# Altium schematic sheet Voltage Regulator.SchDoc
size A; SheetNumber: 3; SheetTotal: 3
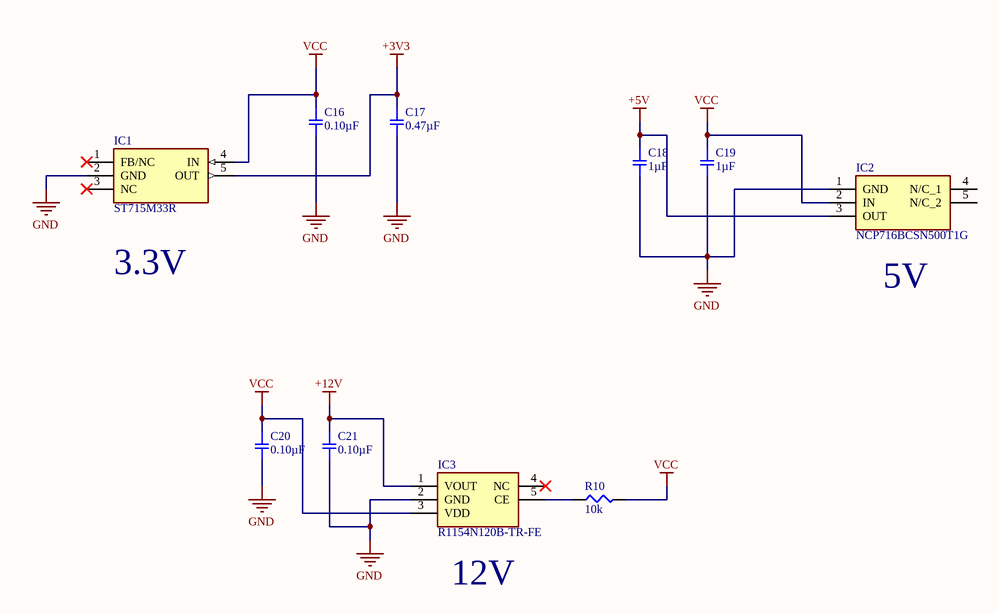
[diagram p0: Voltage Regulator.SchDoc]

## Parts
C16  0.10µF  [SMD-0402C]
C17  0.47µF  [SMD-0402C]
C18  1µF  [SMD-0402C]
C19  1µF  [SMD-0402C]
C20  0.10µF  [SMD-0402C]
C21  0.10µF  [SMD-0402C]
IC1  ST715M33R  [SOT95P280X145-5N]
IC2  NCP716BCSN500T1G  [SOT95P275X110-5N]
IC3  R1154N120B-TR-FE  [SOT95P280X130-5N]
R10  10k  [SMD-0402-RES]

## Nets
+3V3: C17.1 IC1.5(OUT)
+5V: C18.1 IC2.3(OUT)
+12V: C21.1 IC3.1(VOUT)
GND: C16.2 C17.2 C18.2 C19.2 C20.2 C21.2 IC1.2(GND) IC2.1(GND) IC3.2(GND)
VCC: C16.1 C19.1 C20.1 IC1.4(IN) IC2.2(IN) IC3.3(VDD) R10.2
NetIC3_5: IC3.5(CE) R10.1

Not connected (* = marked no-connect by the designer): IC1 1(FB/NC)* 3(NC)*; IC2 4(N/C_1) 5(N/C_2); IC3 4(NC)*

## Notes on the sheet
- 3.3V
- (near IC2) 5V
- (near IC3) 12V

## Library data of the parts
C16 C20 C21 = GCM155R71C104KA55D: CAP CER 0.1UF 16V X7R 0402; Manufacturer: Murata Electronics North America; Factory Stock: 0; Unit Price (USD): 0.1; Minimum Quantity: 1; Tolerance: ±10%; Datasheets: http://www.murata.com/~/media/webrenewal/support/library/catalog/products/capacitor/mlcc/c03e.ashx; Image: //media.digikey.com/Renders/Murata%20Renders/ZRB-SERIES-0402.jpg; Digi-Key Part Number: 490-4759-1-ND; Part Number: GCM155R71C104KA55D; Quantity Available: 734194; @ qty: 0; Packaging: Cut Tape (CT); Series: GCM; Part Status: Active; Value: 0.10µF; Voltage: 16V; Temperature Coefficient: X7R; Operating Temperature: -55°C ~ 125°C; Features: -; Ratings: AEC-Q200; Applications: Automotive; Mounting Type: Surface Mount, MLCC; Package / Case: 0402 (1005 Metric); Size / Dimension: 0.039" L x 0.020" W (1.00mm x 0.50mm); Height - Seated (Max): -; Thickness (Max): 0.022" (0.55mm); Lead Spacing: -; Lead Style: -
C17 = GRM155R61C474KE01D: CAP CER 0.47UF 16V X5R 0402; Manufacturer: Murata Electronics North America; Factory Stock: 0; Unit Price (USD): 0.1; Minimum Quantity: 1; Tolerance: ±10%; Datasheets: http://www.murata.com/~/media/webrenewal/support/library/catalog/products/capacitor/mlcc/c02e.pdf; Image: //media.digikey.com/Renders/Murata%20Renders/ZRB-SERIES-0402.jpg; Digi-Key Part Number: 490-13421-1-ND; Part Number: GRM155R61C474KE01D; Quantity Available: 8585; @ qty: 0; Packaging: Cut Tape (CT); Series: GRM; Part Status: Active; Value: 0.47µF; Voltage: 16V; Temperature Coefficient: X5R; Operating Temperature: -55°C ~ 85°C; Features: -; Ratings: -; Applications: General Purpose; Mounting Type: Surface Mount, MLCC; Package / Case: 0402 (1005 Metric); Size / Dimension: 0.039" L x 0.020" W (1.00mm x 0.50mm); Height - Seated (Max): -; Thickness (Max): 0.022" (0.55mm); Lead Spacing: -; Lead Style: -
C18 C19 = GRM155C81C105KE11D: CAP CER 1UF 16V X6S 0402; Manufacturer: Murata Electronics North America; Factory Stock: 0; Unit Price (USD): 0.29; Minimum Quantity: 1; Tolerance: ±10%; Datasheets: http://www.murata.com/~/media/webrenewal/support/library/catalog/products/capacitor/mlcc/c02e.pdf; Image: //media.digikey.com/Renders/Murata%20Renders/ZRB-SERIES-0402.jpg; Digi-Key Part Number: 490-12700-1-ND; Part Number: GRM155C81C105KE11D; Quantity Available: 37242; @ qty: 0; Packaging: Cut Tape (CT); Series: GRM; Part Status: Active; Value: 1µF; Voltage: 16V; Temperature Coefficient: X6S; Operating Temperature: -55°C ~ 105°C; Features: -; Ratings: -; Applications: General Purpose; Mounting Type: Surface Mount, MLCC; Package / Case: 0402 (1005 Metric); Size / Dimension: 0.039" L x 0.020" W (1.00mm x 0.50mm); Height - Seated (Max): -; Thickness (Max): 0.024" (0.60mm); Lead Spacing: -; Lead Style: -
IC1 = ST715M33R: Integrated Circuit; Manufacturer_Name: STMicroelectronics; Datasheet Link: https://datasheet.datasheetarchive.com/originals/distributors/Datasheets-DGA25/1774080.pdf; Height: 1.45mm; Manufacturer_Part_Number: ST715M33R; Mouser Part Number: 511-ST715M33R; Mouser Price/Stock: https://www.mouser.co.uk/ProductDetail/STMicroelectronics/ST715M33R?qs=SU4Xa%252BYHGQp%252B3Qoof482xw%3D%3D; Arrow Part Number: ST715M33R; Arrow Price/Stock: https://www.arrow.com/en/products/st715m33r/stmicroelectronics?region=nac
IC2 = NCP716BCSN500T1G: Integrated Circuit; Manufacturer_Name: onsemi; Datasheet Link: https://www.mouser.jp/datasheet/2/308/NCP716BC_D-2255835.pdf; Height: 1.1mm; Manufacturer_Part_Number: NCP716BCSN500T1G; Mouser Part Number: 863-NCP716BCSN500T1G; Mouser Price/Stock: https://www.mouser.co.uk/ProductDetail/onsemi/NCP716BCSN500T1G?qs=stqOd1AaK79aqdrzlQcxdg%3D%3D; Arrow Part Number: NCP716BCSN500T1G; Arrow Price/Stock: https://www.arrow.com/en/products/ncp716bcsn500t1g/on-semiconductor?region=nac
IC3 = R1154N120B-TR-FE: Integrated Circuit; Manufacturer_Name: Nisshinbo; Datasheet Link: https://www.nisshinbo-microdevices.co.jp/en/pdf/datasheet/r1154-ea.pdf; Height: 1.3mm; Manufacturer_Part_Number: R1154N120B-TR-FE; Mouser Part Number: 848-R1154N120BTRFE; Mouser Price/Stock: https://www.mouser.co.uk/ProductDetail/Nisshinbo/R1154N120B-TR-FE?qs=ilL34mSzaLixPjYq%2FYViaw%3D%3D
R10 = ERJ-2GEJ103X: RES SMD 10K OHM 5% 1/10W 0402; Manufacturer: Panasonic Electronic Components; Factory Stock: 0; Unit Price (USD): 0.00350; @ qty: 1500; Minimum Quantity: 1; Power (Watts): 0.1W, 1/10W; Temperature Coefficient: ±200ppm/°C; Part Number: ERJ-2GEJ103X; Datasheets: http://industrial.panasonic.com/www-cgi/jvcr13pz.cgi?E+PZ+3+AOA0001+ERJ2GEJ103X+7+WW; Image: //media.digikey.com/Photos/Panasonic%20Photos/ERJ-PA2-Series.jpg; Digi-Key Part Number: P10KJCT-ND; Quantity Available: 2560215; Packaging: Cut Tape (CT); Series: ERJ; Part Status: Active; Value: 10k; Tolerance: ±5%; Composition: Thick Film; Features: Automotive AEC-Q200; Operating Temperature: -55°C ~ 155°C; Package / Case: 0402 (1005 Metric); Supplier Device Package: 0402; Size / Dimension: 0.039" L x 0.020" W (1.00mm x 0.50mm); Height - Seated (Max): 0.016" (0.40mm); Number of Terminations: 2; Failure Rate: -